# Altium project MC3_r2.PrjPcb (part 2 of 10)

## Sheet MC3_microcontroller.SchDoc
size Letter; DocumentNumber: D_17; SheetNumber: 17; SheetTotal: 21
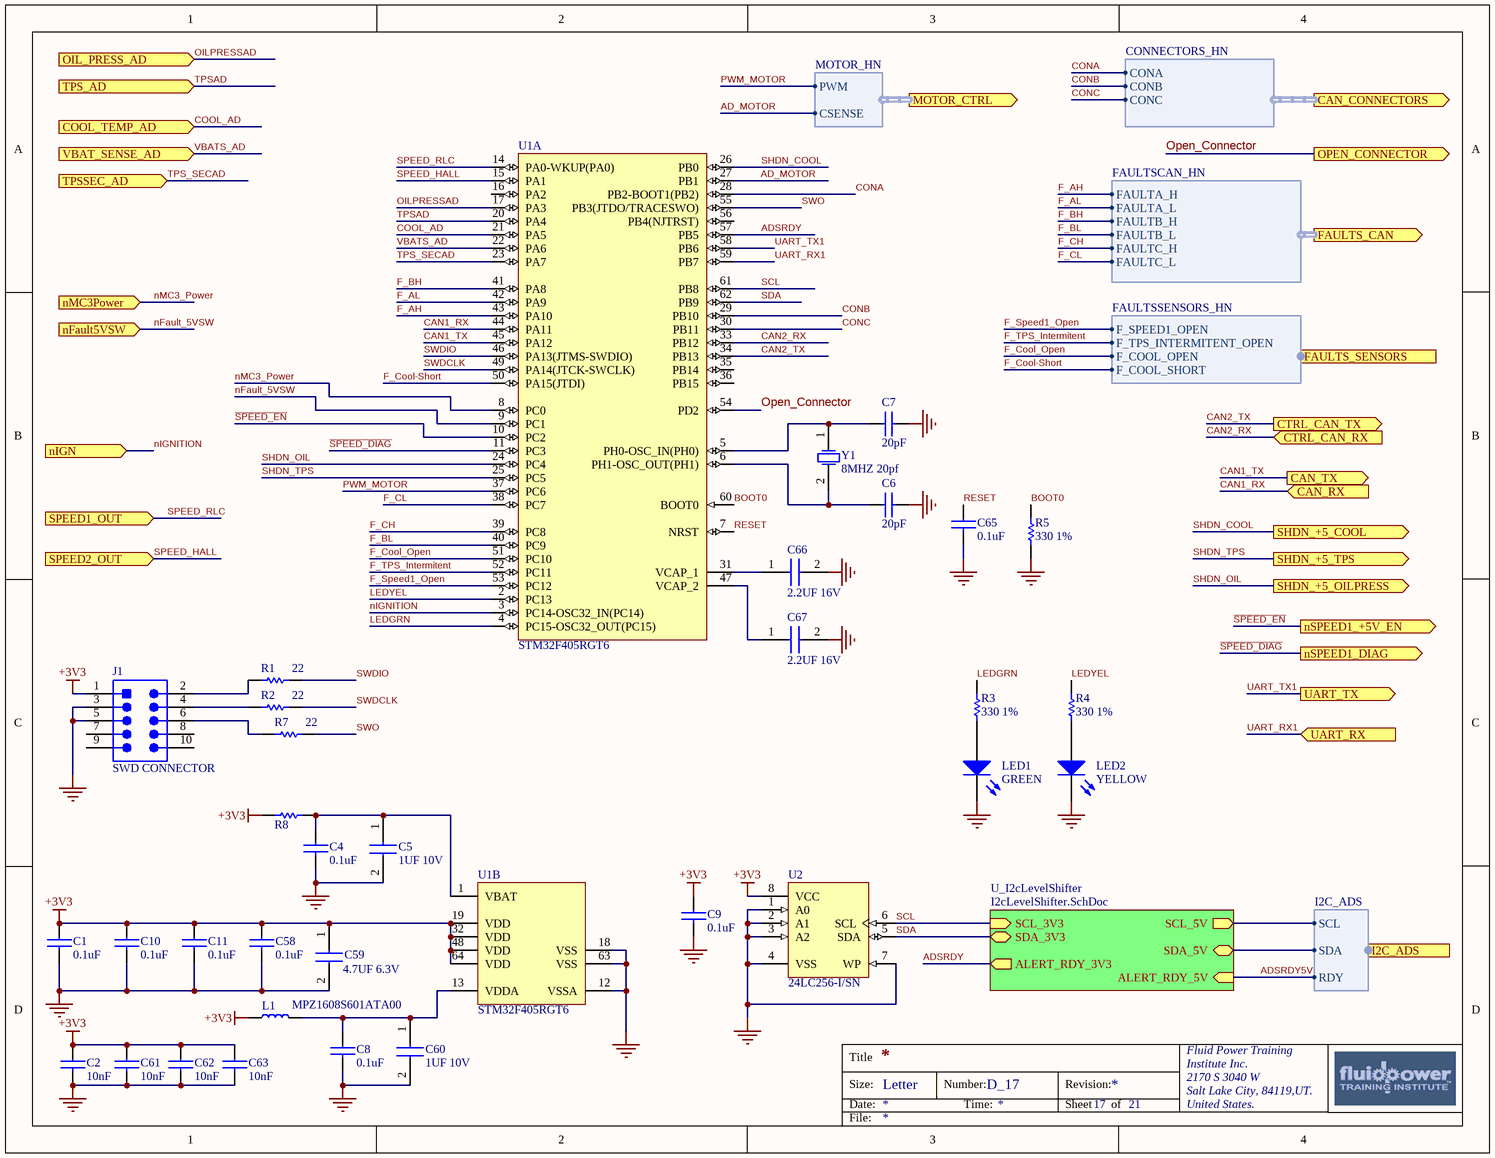
[diagram p4: MC3_microcontroller.SchDoc]

### Parts
C1  0.1uF  [C0805]
C2  10nF  [C0805]
C4  0.1uF  [C0805]
C5  1UF 10V  [CAPC1608X90X20LL10]
C6  20pF  [C0805]
C7  20pF  [C0805]
C8  0.1uF  [C0805]
C9  0.1uF  [C0805]
C10  0.1uF  [C0805]
C11  0.1uF  [C0805]
C58  0.1uF  [C0805]
C59  4.7UF 6.3V  [CAPC1608X90X20LL10]
C60  1UF 10V  [CAPC1608X90X20LL10]
C61  10nF  [C0805]
C62  10nF  [C0805]
C63  10nF  [C0805]
C65  0.1uF  [C0805]
C66  2.2UF 16V  [CAPC1608X09M]
C67  2.2UF 16V  [CAPC1608X09M]
J1  SWD CONNECTOR  [SMTC-FTSH-105-01-L-DV-K_V]
L1  MPZ1608S601ATA00  [INDC1608X06L]
LED1  GREEN  [LED0805]
LED2  YELLOW  [LED0805]
R1  22  [R0805]
R2  22  [R0805]
R3  330 1%  [R0805]
R4  330 1%  [R0805]
R5  330 1%  [R0805]
R7  22  [R0805]
R8  0 OHM  [R0805]  (value not drawn)
U1  STM32F405RGT6  [STM-LQFP64_V]  (parts A,B of 2)
U2  24LC256-I/SN  [SOIC-SN8_L]
Y1  8MHZ 20pf  [HC49US]

### Sub-sheets
U_I2cLevelShifter = I2cLevelShifter.SchDoc: SDA_3V3 (bidir), SDA_5V (bidir), SCL_3V3 (in), SCL_5V (out), ALERT_RDY_3V3 (out), ALERT_RDY_5V (in)

### Ports
CAN_CONNECTORS (out, harness CONNECTORS_HN), CAN_RX (in), CAN_TX (out), COOL_TEMP_AD (in), CTRL_CAN_RX (in), CTRL_CAN_TX (out), FAULTS_CAN (out, harness FAULTSCAN_HN), FAULTS_SENSORS (in, harness FAULTSSENSORS_HN), I2C_ADS (in, harness I2C_ADS), MOTOR_CTRL (out, harness MOTOR_HN), nFault5VSW (in), nIGN (in), nMC3Power (in), nSPEED1_+5V_EN (out), nSPEED1_DIAG (out), OIL_PRESS_AD (in), OPEN_CONNECTOR (out), SHDN_+5_COOL (out), SHDN_+5_OILPRESS (out), SHDN_+5_TPS (out), SPEED1_OUT (in), SPEED2_OUT (in), TPS_AD (in), TPSSEC_AD (in), UART_RX (in), UART_TX (out), VBAT_SENSE_AD (in)

### Harnesses
I2C_ADS: SCL, SDA, RDY
MOTOR_HN: PWM, CSENSE
FAULTSCAN_HN: FAULTA_H, FAULTA_L, FAULTB_H, FAULTB_L, FAULTC_H, FAULTC_L
CONNECTORS_HN: CONA, CONB, CONC
FAULTSSENSORS_HN: F_SPEED1_OPEN, F_TPS_INTERMITENT_OPEN, F_COOL_OPEN, F_COOL_SHORT

### Nets
+3V3: C1.1 C2.1 C9.1 C10.1 C11.1 C58.1 C59.1 C61.1 C62.1 C63.1 J1.1 L1.1 R8.1 U1.19(VDD) U1.32(VDD) U1.48(VDD) U1.64(VDD) U2.8(VCC)
GND: C1.2 C2.2 C4.2 C5.2 C6.2 C7.2 C8.2 C9.2 C10.2 C11.2 C58.2 C59.2 C60.2 C61.2 C62.2 C63.2 C65.2 C66.2 C67.2 J1.3 J1.5 LED1.1(K) LED2.1(K) R5.1 U1.12(VSSA) U1.18(VSS) U1.63(VSS) U2.1(A0) U2.2(A1) U2.3(A2) U2.4(VSS) U2.7(WP)
~{SPEED_DIAG}: U1.11(PC3) ; port nSPEED1_DIAG
~{SPEED_EN}: U1.10(PC2) ; port nSPEED1_+5V_EN
AD_MOTOR: U1.27(PB1) ; port MOTOR_CTRL.CSENSE
ADSRDY: U1.57(PB5) ; sheet U_I2cLevelShifter/ALERT_RDY_3V3
ADSRDY5V: sheet U_I2cLevelShifter/ALERT_RDY_5V, port I2C_ADS.RDY
BOOT0: R5.2 U1.60(BOOT0)  [project net BOOT0_17]
CAN1_RX: U1.44(PA11) ; port CAN_RX
CAN1_TX: U1.45(PA12) ; port CAN_TX
CAN2_RX: U1.33(PB12) ; port CTRL_CAN_RX
CAN2_TX: U1.34(PB13) ; port CTRL_CAN_TX
CONA: U1.28(PB2-BOOT1(PB2)) ; port CAN_CONNECTORS.CONA
CONB: U1.29(PB10) ; port CAN_CONNECTORS.CONB
CONC: U1.30(PB11) ; port CAN_CONNECTORS.CONC
COOL_AD: U1.21(PA5) ; port COOL_TEMP_AD
F_AH: U1.43(PA10) ; port FAULTS_CAN.FAULTA_H  [project net FAULTAH]
F_AL: U1.42(PA9) ; port FAULTS_CAN.FAULTA_L  [project net FAULTAL]
F_BH: U1.41(PA8) ; port FAULTS_CAN.FAULTB_H  [project net FAULTBH]
F_BL: U1.40(PC9) ; port FAULTS_CAN.FAULTB_L  [project net FAULTBL]
F_CH: U1.39(PC8) ; port FAULTS_CAN.FAULTC_H  [project net FAULTCH]
F_CL: U1.38(PC7) ; port FAULTS_CAN.FAULTC_L  [project net FAULTCL]
F_Cool-Short: U1.50(PA15(JTDI)) ; port FAULTS_SENSORS.F_COOL_SHORT
F_Cool_Open: U1.51(PC10) ; port FAULTS_SENSORS.F_COOL_OPEN
F_Speed1_Open: U1.53(PC12) ; port FAULTS_SENSORS.F_SPEED1_OPEN
F_TPS_Intermitent: U1.52(PC11) ; port FAULTS_SENSORS.F_TPS_INTERMITENT_OPEN
LEDGRN: R3.2 U1.4(PC15-OSC32_OUT(PC15))  [project net LEDGRN_17]
LEDYEL: R4.2 U1.2(PC13)  [project net LEDYEL_17]
nFault_5VSW: U1.9(PC1) ; port nFault5VSW  [project net nFault5VSW]
nIGNITION: U1.3(PC14-OSC32_IN(PC14)) ; port nIGN
nMC3_Power: U1.8(PC0) ; port nMC3Power  [project net nMC3Power]
OILPRESSAD: U1.17(PA3) ; port OIL_PRESS_AD
Open_Connector: U1.54(PD2) ; port OPEN_CONNECTOR
PWM_MOTOR: U1.37(PC6) ; port MOTOR_CTRL.PWM
RESET: C65.1 U1.7(NRST)  [project net RESET_17]
SCL: U1.61(PB8) U2.6(SCL) ; sheet U_I2cLevelShifter/SCL_3V3
SDA: U1.62(PB9) U2.5(SDA) ; sheet U_I2cLevelShifter/SDA_3V3
SHDN_COOL: U1.26(PB0) ; port SHDN_+5_COOL
SHDN_OIL: U1.24(PC4) ; port SHDN_+5_OILPRESS
SHDN_TPS: U1.25(PC5) ; port SHDN_+5_TPS
SPEED_HALL: U1.15(PA1) ; port SPEED2_OUT
SPEED_RLC: U1.14(PA0-WKUP(PA0)) ; port SPEED1_OUT
SWDCLK: R2.2 U1.49(PA14(JTCK-SWCLK))  [project net SWDCLK_17]
SWDIO: R1.2 U1.46(PA13(JTMS-SWDIO))  [project net SWDIO_17]
SWO: R7.2 U1.55(PB3(JTDO/TRACESWO))  [project net SWO_17]
TPS_SECAD: U1.23(PA7) ; port TPSSEC_AD
TPSAD: U1.20(PA4) ; port TPS_AD
UART_RX1: U1.59(PB7) ; port UART_RX
UART_TX1: U1.58(PB6) ; port UART_TX
VBATS_AD: U1.22(PA6) ; port VBAT_SENSE_AD
NetC4_1: C4.1 C5.1 R8.2 U1.1(VBAT)
NetC6_1: C6.1 U1.6(PH1-OSC_OUT(PH1)) Y1.2
NetC7_1: C7.1 U1.5(PH0-OSC_IN(PH0)) Y1.1
NetC8_1: C8.1 C60.1 L1.2 U1.13(VDDA)
NetC66_1: C66.1 U1.31(VCAP_1)
NetC67_1: C67.1 U1.47(VCAP_2)
NetIC1_9: sheet U_I2cLevelShifter/SDA_5V, port I2C_ADS.SDA
NetIC1_10: sheet U_I2cLevelShifter/SCL_5V, port I2C_ADS.SCL
NetJ1_2: J1.2 R1.1
NetJ1_4: J1.4 R2.1
NetJ1_6: J1.6 R7.1
NetLED1_2: LED1.2(A) R3.1
NetLED2_2: LED2.2(A) R4.1

Not connected (* = marked no-connect by the designer): J1 7 8 9 10; U1 16(PA2) 35(PB14) 36(PB15) 56(PB4(NJTRST))

### Notes on the sheet
- Title
- Size:
- Date:
- Letter
- Number:
- Time:
- Revision:
- Sheet
- of
- Fluid Power Training
- Institute Inc.
- 2170 S 3040 W
- Salt Lake City, 84119,UT.
- United States.
- File:

### Library data of the parts
C1 C4 C8-C11 C58 C65 = C0805C104K5RACTU: Cap Ceramic 0.1uF 50V X7R 10% SMD 2.0 x 1.2 mm 125 C Paper T/R; Manufacturer: KEMET; Capacitance: 100nF; Voltage: 500V; Supplier 1: Mouser; Supplier Part Number 1: 80-C0805C104K5R; Manufacturer Part Number: C0805C104K5RACTU; RoHS: Yes; Category: Ceramic Capacitors; Stock 1: 4177670; Pricing 1: 1=0.17000, 10=0.10400, 100=0.05600, 500=0.03900, 1000=0.03200, 4000=0.02400 (USD); Mount: Surface Mount,PCB; Case/Package: 0805; Number of Pins: 2; Case Code (Imperial): 0805; Case Code (Metric): 2012; Dielectric Material: Ceramic; Contact Plating: Tin,Matte; Min Operating Temperature: -55°C; Max Operating Temperature: 125°C; Voltage Rating: 50V; Tolerance: 10%; Packaging: Tape and Reel; Dielectric: X7R; Package Quantity: 4000; Voltage Rating (DC): 50V; Termination: SMD/SMT; Length: 2mm; Height: 0.9mm; Width: 1.2mm; Depth: 1.25mm; Thickness: 0.035inch; Lead Pitch: 0.75mm; Radiation Hardening: No; REACH SVHC: No SVHC; ComponentLink1URL: https://datasheet.ciiva.com/14589/70095383-14589048.pdf?src-supplier=Allied+Electronics; ComponentLink1Description: https://datasheet.ciiva.com/14589/70095383-14589048.pdf?src-supplier=Allied+Electronics; ComponentLink2URL: https://datasheet.ciiva.com/28682/1851736-28682232.pdf?src-supplier=Element14; ComponentLink2Description: https://datasheet.ciiva.com/28682/1851736-28682232.pdf?src-supplier=Element14; ComponentLink3URL: https://datasheet.ciiva.com/32431/slceramic-chip-condensers-e-32431755.pdf?src-supplier=Distrelec; ComponentLink3Description: https://datasheet.ciiva.com/32431/slceramic-chip-condensers-e-32431755.pdf?src-supplier=Distrelec; ComponentLink4URL: https://datasheet.ciiva.com/18410/70095383-18410815.pdf?src-supplier=Allied+Electronics; ComponentLink4Description: https://datasheet.ciiva.com/18410/70095383-18410815.pdf?src-supplier=Allied+Electronics
C2 C61-C63 = CC0805KRX7R9BB103: YAGEO - CC0805KRX7R9BB103 - SMD Multilayer Ceramic Capacitor, 10000 pF, 50 V, 0805 [2012 Metric], ± 10%, X7R, CC Series; Voltage Rating: 50V; Insulation Resistance: 100GR; Supplier 1: Mouser; Supplier Part Number 1: 603-CC805KRX7R9BB103; Manufacturer: Yageo; Manufacturer Part Number: CC0805KRX7R9BB103; RoHS: Yes; Category: Ceramic Capacitors; Stock 1: 473100; Pricing 1: 1=0.11000, 10=0.05700, 100=0.02600, 1000=0.02100, 4000=0.01600, 8000=0.01400 (USD); Mount: Surface Mount; Case/Package: 0805; Number of Pins: 2; Case Code (Imperial): 0805; Case Code (Metric): 2012; Material: Ceramic; Min Operating Temperature: -55°C; Max Operating Temperature: 125°C; Packaging: Tape and Reel; Capacitance: 10nF; Tolerance: 10%; Package Quantity: 1; Dielectric: X7R; Termination: SMD/SMT; Voltage Rating (DC): 50V; Voltage: 50V; Composition: Ceramic; Length: 2mm; Height: 0.6mm; Width: 1.25mm; Depth: 1.25mm; Thickness: 0.024inch; Radiation Hardening: No; REACH SVHC: No SVHC; Lead Free: Lead Free; Halogen Free: Halogen Free; ComponentLink1URL: https://datasheet.ciiva.com/11786/0900766b80d84f1d-11786119.pdf?src-supplier=RSComponents; ComponentLink1Description: https://datasheet.ciiva.com/11786/0900766b80d84f1d-11786119.pdf?src-supplier=RSComponents; ComponentLink2URL: https://datasheet.ciiva.com/25613/0900766b8027bcf6-25613113.pdf?src-supplier=RSComponents; ComponentLink2Description: https://datasheet.ciiva.com/25613/0900766b8027bcf6-25613113.pdf?src-supplier=RSComponents; ComponentLink3URL: https://datasheet.ciiva.com/144/mlccorderingcode-144533.pdf?src-supplier=Digi-Key; ComponentLink3Description: https://datasheet.ciiva.com/144/mlccorderingcode-144533.pdf?src-supplier=Digi-Key; ComponentLink4URL: https://datasheet.ciiva.com/144/mlccorderingcode-144534.pdf?src-supplier=Digi-Key; ComponentLink4Description: https://datasheet.ciiva.com/144/mlccorderingcode-144534.pdf?src-supplier=Digi-Key; ComponentLink5URL: https://datasheet.ciiva.com/46372/1784427-46372638.pdf?src-supplier=Element14; ComponentLink5Description: https://datasheet.ciiva.com/46372/1784427-46372638.pdf?src-supplier=Element14; ComponentLink6URL: https://datasheet.ciiva.com/144/mlccorderingcode-144532.pdf?src-supplier=Digi-Key; ComponentLink6Description: https://datasheet.ciiva.com/144/mlccorderingcode-144532.pdf?src-supplier=Digi-Key; ComponentLink7URL: https://datasheet.ciiva.com/16625/upy-gphc-x7r-6-3v-to-50v-8-16625548.pdf?src-supplier=Avnet+Europe; ComponentLink7Description: https://datasheet.ciiva.com/16625/upy-gphc-x7r-6-3v-to-50v-8-16625548.pdf?src-supplier=Avnet+Europe; ComponentLink8URL: https://datasheet.ciiva.com/22749/1489800-22749215.pdf?src-supplier=Element14; ComponentLink8Description: https://datasheet.ciiva.com/22749/1489800-22749215.pdf?src-supplier=Element14; ComponentLink9URL: https://datasheet.ciiva.com/46372/1734573-46372639.pdf?src-supplier=Element14; ComponentLink9Description: https://datasheet.ciiva.com/46372/1734573-46372639.pdf?src-supplier=Element14
C5 C60 = C0603C105K8PACTU: Cap Ceramic 1uF 10V X5R 10% SMD 0603 85°C Paper T/R; Manufacturer: KEMET; Supplier 1: Mouser; Supplier Part Number 1: 80-C0603C105K8P; Manufacturer Part Number: C0603C105K8PACTU; RoHS: Yes; Category: Ceramic Capacitors; Stock 1: 122683; Pricing 1: 1=0.10000, 10=0.06100, 100=0.02700, 500=0.01900, 1000=0.01500, 4000=0.01100 (USD); Mount: Surface Mount; Case/Package: 0603; Number of Pins: 2; Weight: 7.1E-05oz; Case Code (Imperial): 0603; Case Code (Metric): 1608; Dielectric Material: Ceramic; Min Operating Temperature: -55°C; Max Operating Temperature: 85°C; Tolerance: 10%; Capacitance: 1uF; Packaging: Tape and Reel; Dielectric: X5R; Voltage Rating (DC): 10V; Voltage Rating: 10V; Package Quantity: 1; Termination: SMD/SMT; Voltage: 10V; Length: 1.6mm; Height: 0.8mm; Depth: 0.8mm; Width: 0.031inch; Thickness: 0.035inch; Radiation Hardening: No; REACH SVHC: No SVHC; Lead Free: Lead Free; ComponentLink1URL: https://datasheet.ciiva.com/11787/0900766b8116eb59-11787747.pdf?src-supplier=RSComponents; ComponentLink1Description: https://datasheet.ciiva.com/11787/0900766b8116eb59-11787747.pdf?src-supplier=RSComponents; ComponentLink2URL: https://datasheet.ciiva.com/7823/1929483-7823999.pdf?src-supplier=Element14; ComponentLink2Description: https://datasheet.ciiva.com/7823/1929483-7823999.pdf?src-supplier=Element14; ComponentLink3URL: https://datasheet.ciiva.com/6074/40889-6074647.pdf?src-supplier=Farnell; ComponentLink3Description: https://datasheet.ciiva.com/6074/40889-6074647.pdf?src-supplier=Farnell; ComponentLink4URL: https://datasheet.ciiva.com/28645/1831760-28645655.pdf?src-supplier=Element14; ComponentLink4Description: https://datasheet.ciiva.com/28645/1831760-28645655.pdf?src-supplier=Element14; ComponentLink5URL: https://datasheet.ciiva.com/26847/getdatasheetpartid-385480-26847548.pdf?src-supplier=Verical; ComponentLink5Description: https://datasheet.ciiva.com/26847/getdatasheetpartid-385480-26847548.pdf?src-supplier=Verical; ComponentLink6URL: https://datasheet.ciiva.com/7823/40889-7823998.pdf?src-supplier=Element14; ComponentLink6Description: https://datasheet.ciiva.com/7823/40889-7823998.pdf?src-supplier=Element14
C6 C7 = 08051A200JAT2A: AVX - 08051A200JAT2A - CERAMIC CAPACITOR 20PF 100V, C0G, 5%, 0805, FULL REEL; Manufacturer: Kyocera AVX; Dissipation Factor: 10%; Temperature Coefficient: 30ppm/°C; Supplier 1: Mouser; Supplier Part Number 1: 581-08051A200JAT2A; Manufacturer Part Number: 08051A200JAT2A; RoHS: Yes; Category: Ceramic Capacitors; Stock 1: 29281; Pricing 1: 1=0.29000, 10=0.19900, 100=0.10000, 500=0.06900, 1000=0.06100, 2000=0.06100 (USD); Mount: Surface Mount,PCB; Case/Package: 0805; Number of Pins: 2; Case Code (Imperial): 0805; Case Code (Metric): 2012; Contact Plating: Tin,Matte; Min Operating Temperature: -55°C; Max Operating Temperature: 125°C; Capacitance: 20pF; Packaging: Tape and Reel; Voltage Rating: 100V; Package Quantity: 1; Tolerance: 5%; Voltage Rating (DC): 100V; Dielectric: C0G; Termination: SMD/SMT; Voltage: 100V; Length: 2.01mm; Height: 940um; Width: 1.25mm; Thickness: 0.037inch; Depth: 1.25mm; Radiation Hardening: No; Lead Free: Lead Free; REACH SVHC: No SVHC; ComponentLink1URL: https://datasheet.ciiva.com/11787/0900766b80def0e2-11787350.pdf?src-supplier=RSComponents; ComponentLink1Description: https://datasheet.ciiva.com/11787/0900766b80def0e2-11787350.pdf?src-supplier=RSComponents; ComponentLink2URL: https://datasheet.ciiva.com/26927/getdatasheetpartid-58326-26927326.pdf?src-supplier=Verical; ComponentLink2Description: https://datasheet.ciiva.com/26927/getdatasheetpartid-58326-26927326.pdf?src-supplier=Verical; ComponentLink3URL: https://datasheet.ciiva.com/11536/ccog-11536935.pdf?src-supplier=Avnet; ComponentLink3Description: https://datasheet.ciiva.com/11536/ccog-11536935.pdf?src-supplier=Avnet; ComponentLink4URL: https://datasheet.ciiva.com/151/ccog-151320.pdf?src-supplier=Digi-Key; ComponentLink4Description: https://datasheet.ciiva.com/151/ccog-151320.pdf?src-supplier=Digi-Key; ComponentLink5URL: https://datasheet.ciiva.com/151/ccog-151321.pdf?src-supplier=Digi-Key; ComponentLink5Description: https://datasheet.ciiva.com/151/ccog-151321.pdf?src-supplier=Digi-Key; ComponentLink6URL: https://datasheet.ciiva.com/28535/759117-28535065.pdf?src-supplier=Element14; ComponentLink6Description: https://datasheet.ciiva.com/28535/759117-28535065.pdf?src-supplier=Element14; ComponentLink7URL: https://datasheet.ciiva.com/151/ccog-151322.pdf?src-supplier=Digi-Key; ComponentLink7Description: https://datasheet.ciiva.com/151/ccog-151322.pdf?src-supplier=Digi-Key; ComponentLink8URL: https://datasheet.ciiva.com/14606/70001039-14606635.pdf?src-supplier=Allied+Electronics; ComponentLink8Description: https://datasheet.ciiva.com/14606/70001039-14606635.pdf?src-supplier=Allied+Electronics; ComponentLink9URL: https://datasheet.ciiva.com/14595/70001039-14595420.pdf?src-supplier=Allied+Electronics; ComponentLink9Description: https://datasheet.ciiva.com/14595/70001039-14595420.pdf?src-supplier=Allied+Electronics; ComponentLink10URL: https://datasheet.ciiva.com/2987/ccog-2987917.pdf?src-supplier=Avnet; ComponentLink10Description: https://datasheet.ciiva.com/2987/ccog-2987917.pdf?src-supplier=Avnet; ComponentLink11URL: https://datasheet.ciiva.com/17492/ccog-17492879.pdf?src-supplier=Avnet+Europe; ComponentLink11Description: https://datasheet.ciiva.com/17492/ccog-17492879.pdf?src-supplier=Avnet+Europe
C59 = C0603C475K9PACTU: KEMET - C0603C475K9PACTU - KONDENSATOR, 4.7µF, 6.3V, 10%, X5R, 0603; Dielectric Material: Ceramic; Dissipation Factor: 5%; Supplier 1: Mouser; Supplier Part Number 1: 80-C0603C475K9P; Manufacturer: KEMET; Manufacturer Part Number: C0603C475K9PACTU; RoHS: Yes; Category: Ceramic Capacitors; Stock 1: 258514; Pricing 1: 1=0.17000, 10=0.12000, 100=0.05600, 500=0.03900, 1000=0.03200, 4000=0.02400 (USD); Mount: Surface Mount,PCB; Case/Package: 0603; Number of Pins: 2; Case Code (Metric): 1608; Case Code (Imperial): 0603; Contact Plating: Tin,Matte; Min Operating Temperature: -55°C; Max Operating Temperature: 85°C; Capacitance: 4.7uF; Voltage Rating: 6.3V; Tolerance: 10%; Packaging: Tape and Reel; Package Quantity: 1; Voltage Rating (DC): 6.3V; Termination: SMD/SMT; Dielectric: X5R; Voltage: 6.3V; Length: 1.6mm; Height: 0.8mm; Width: 0.031inch; Depth: 0.8mm; Thickness: 0.035inch; Lead Pitch: 0.7mm; Radiation Hardening: No; Lead Free: Lead Free; REACH SVHC: No SVHC; ComponentLink1URL: https://datasheet.ciiva.com/145/docfinderpartnumber-c0603c475k9pactu-145072.pdf?src-supplier=Digi-Key; ComponentLink1Description: https://datasheet.ciiva.com/145/docfinderpartnumber-c0603c475k9pactu-145072.pdf?src-supplier=Digi-Key; ComponentLink2URL: https://datasheet.ciiva.com/7823/1732700-7823808.pdf?src-supplier=Element14; ComponentLink2Description: https://datasheet.ciiva.com/7823/1732700-7823808.pdf?src-supplier=Element14; ComponentLink3URL: https://datasheet.ciiva.com/28682/1789732-28682301.pdf?src-supplier=Element14; ComponentLink3Description: https://datasheet.ciiva.com/28682/1789732-28682301.pdf?src-supplier=Element14; ComponentLink4URL: https://datasheet.ciiva.com/7824/40889-7824047.pdf?src-supplier=Element14; ComponentLink4Description: https://datasheet.ciiva.com/7824/40889-7824047.pdf?src-supplier=Element14
C66 C67 = C0603C225K4PACTU: KEMET - C0603C225K4PACTU - CAP, MLCC, X5R, 2.2UF, 16V, 0603; Dielectric Material: Ceramic; Tolerance: 10%; Dissipation Factor: 5%; Supplier 1: Mouser; Supplier Part Number 1: 80-C0603C225K4P; Manufacturer: KEMET; Manufacturer Part Number: C0603C225K4PACTU; RoHS: Yes; Category: Ceramic Capacitors; Stock 1: 77579; Pricing 1: 1=0.14000, 10=0.10300, 100=0.04800, 500=0.03400, 1000=0.02800, 4000=0.02000 (USD); Mount: Surface Mount; Case/Package: 0603; Number of Pins: 2; Case Code (Imperial): 0603; Case Code (Metric): 1608; Contact Plating: Tin,Matte; Min Operating Temperature: -55°C; Max Operating Temperature: 85°C; Capacitance: 2.2uF; Voltage Rating: 16V; Voltage Rating (DC): 16V; Packaging: Tape and Reel; Package Quantity: 1; Termination: SMD/SMT; Dielectric: X5R; Voltage: 16V; Length: 1.6mm; Height: 0.8mm; Width: 0.8mm; Depth: 0.8mm; Thickness: 0.034inch; Radiation Hardening: No; Lead Free: Lead Free; REACH SVHC: No SVHC; ComponentLink1URL: https://datasheet.ciiva.com/5969/1776083-5969304.pdf?src-supplier=Farnell; ComponentLink1Description: https://datasheet.ciiva.com/5969/1776083-5969304.pdf?src-supplier=Farnell; ComponentLink2URL: https://datasheet.ciiva.com/7823/1776083-7823706.pdf?src-supplier=Element14; ComponentLink2Description: https://datasheet.ciiva.com/7823/1776083-7823706.pdf?src-supplier=Element14
J1 = FTSH-105-01-F-DV-K: SAMTEC - FTSH-105-01-F-DV-K - HEADER, 1.27 MM, SURFACE MOUNT, 10 CONTACTS; Number of Contacts: 10; Connector Type: Male Pin; Max Current Rating: 1.75A; Pitch: 1.27mm; Row Spacing: 0.05inch; Supplier 1: Mouser; Supplier Part Number 1: 200-FTSH10501FDVK; Manufacturer: Samtec; Manufacturer Part Number: FTSH-105-01-F-DV-K; RoHS: Yes; Category: Headers and Wire Housings; Stock 1: 5484; Pricing 1: 1=3.02000, 10=2.55000, 25=2.20000, 100=1.97000, 250=1.86000, 500=1.62000 (USD); Mount: Surface Mount; Contact Plating: Gold; Contact Material: Copper,Bronze; Housing Color: Black; Housing Material: Polymer; Color: Black; Min Operating Temperature: -55°C; Max Operating Temperature: 125°C; Number of Rows: 2; Termination: Solder; Packaging: Rail/Tube; Orientation: Straight; Number of Positions: 10; Package Quantity: 1; Length: 15.2mm; Height: 3.3mm; Depth: 3.43mm; Contact Mating Length: 0.12inch; Radiation Hardening: No; Lead Free: Lead Free; ComponentLink1URL: https://datasheet.ciiva.com/19461/2046846-19461026.pdf?src-supplier=Jameco; ComponentLink1Description: https://datasheet.ciiva.com/19461/2046846-19461026.pdf?src-supplier=Jameco; ComponentLink2URL: https://datasheet.ciiva.com/738/ftsh-1xx-xx-xxx-dv-xxx-mkt-738998.pdf?src-supplier=Digi-Key; ComponentLink2Description: https://datasheet.ciiva.com/738/ftsh-1xx-xx-xxx-dv-xxx-mkt-738998.pdf?src-supplier=Digi-Key; ComponentLink3URL: https://datasheet.ciiva.com/10245/ftsh-mt-10245273.pdf?src-supplier=Avnet; ComponentLink3Description: https://datasheet.ciiva.com/10245/ftsh-mt-10245273.pdf?src-supplier=Avnet; ComponentLink4URL: https://datasheet.ciiva.com/16657/ftsh-mt-16657371.pdf?src-supplier=Avnet+Europe; ComponentLink4Description: https://datasheet.ciiva.com/16657/ftsh-mt-16657371.pdf?src-supplier=Avnet+Europe; ComponentLink5URL: https://datasheet.ciiva.com/15195/getdatasheetpartid-133463-15195260.pdf?src-supplier=Verical; ComponentLink5Description: https://datasheet.ciiva.com/15195/getdatasheetpartid-133463-15195260.pdf?src-supplier=Verical
L1 = MPZ1608S601ATA00: TDK         MPZ1608S601ATA00            FERRITE BEAD, 0.15OHM, 1A, 0603, FULL REEL; Manufacturer: TDK EPCOS; Impedance: 600R; Tolerance: 25%; DC Resistance (DCR): 150mR; Test Frequency: 100MHz; Supplier 1: Mouser; Supplier Part Number 1: 810-MPZ1608S601ATA00; Manufacturer Part Number: MPZ1608S601ATA00; RoHS: Yes; Category: Ferrite Beads and Chips; Stock 1: 62; Pricing 1: 1=0.10000, 10=0.07600, 100=0.03300, 500=0.03000, 1000=0.02600, 4000=0.02000 (USD); Mount: Surface Mount; Case/Package: 0603; Weight: 7.1E-05oz; Core Material: Ferrite; Case Code (Metric): 1608; Case Code (Imperial): 0603; Min Operating Temperature: -55°C; Max Operating Temperature: 125°C; Max DC Current: 1A; Termination: SMD/SMT; Packaging: Tape and Reel; Package Quantity: 4000; Current Rating: 1A; Length: 0.063inch; Height: 0.8mm; Width: 0.8mm; Depth: 0.8mm; Lead Free: Lead Free; REACH SVHC: No SVHC; ComponentLink1URL: https://datasheet.ciiva.com/46381/1795297-46381701.pdf?src-supplier=Element14; ComponentLink1Description: https://datasheet.ciiva.com/46381/1795297-46381701.pdf?src-supplier=Element14; ComponentLink2URL: https://datasheet.ciiva.com/46634/beads-commercial-power-mpz-en-46634518.pdf?src-supplier=Digi-Key; ComponentLink2Description: https://datasheet.ciiva.com/46634/beads-commercial-power-mpz-en-46634518.pdf?src-supplier=Digi-Key; ComponentLink3URL: https://datasheet.ciiva.com/46634/beads-commercial-power-mpz-en-46634462.pdf?src-supplier=Digi-Key; ComponentLink3Description: https://datasheet.ciiva.com/46634/beads-commercial-power-mpz-en-46634462.pdf?src-supplier=Digi-Key; ComponentLink4URL: https://datasheet.ciiva.com/46634/beads-commercial-power-mpz-en-46634494.pdf?src-supplier=Digi-Key; ComponentLink4Description: https://datasheet.ciiva.com/46634/beads-commercial-power-mpz-en-46634494.pdf?src-supplier=Digi-Key
LED1 = 150080VS75000: LED GREEN CLEAR 0805 SMD; Manufacturer: Wurth Electronics; Forward Voltage: 2V; Lens Style: Clear,Rectangular; Luminous Intensity: 40mcd; Forward Current: 30mA; Viewing Angle: 140°; Wavelength: 570nm; Test Current: 20mA; Supplier 1: Mouser; Supplier Part Number 1: 710-150080VS75000; Manufacturer Part Number: 150080VS75000; RoHS: Yes; Category: LEDs; Stock 1: 16574; Pricing 1: 1=0.18000, 10=0.17500, 25=0.17400, 50=0.16200, 100=0.13900, 250=0.12300 (USD); Mount: Surface Mount; Case/Package: 0805; Color: Green; Case Code (Metric): 2012; Case Code (Imperial): 0805; Min Operating Temperature: -40°C; Max Operating Temperature: 85°C; Packaging: Tape and Reel; Dominant Wavelength: 570nm; Package Quantity: 4000; Length: 2mm; Height: 0.7mm; Width: 1.25mm; REACH SVHC: Unknown; ComponentLink1URL: https://datasheet.ciiva.com/22656/150080vs75000-22656966.pdf?src-supplier=Element14; ComponentLink1Description: https://datasheet.ciiva.com/22656/150080vs75000-22656966.pdf?src-supplier=Element14; ComponentLink2URL: https://datasheet.ciiva.com/29279/759437-da-01-en-chipled-0805-w-kl-h-gruen-150080vs7500-29279047.pdf?src-supplier=Conrad; ComponentLink2Description: https://datasheet.ciiva.com/29279/759437-da-01-en-chipled-0805-w-kl-h-gruen-150080vs7500-29279047.pdf?src-supplier=Conrad; ComponentLink3URL: https://datasheet.ciiva.com/29563/150080vs75000-29563018.pdf?src-supplier=Digi-Key; ComponentLink3Description: https://datasheet.ciiva.com/29563/150080vs75000-29563018.pdf?src-supplier=Digi-Key
LED2 = 150080YS75000: LED YELLOW CLEAR 0805 SMD; Manufacturer: Wurth Electronics; Forward Voltage: 2V; Luminous Intensity: 120mcd; Viewing Angle: 140°; Forward Current: 30mA; Lens Style: Clear,Rectangular; Dominant Wavelength: 590nm; Test Current: 20mA; Supplier 1: Mouser; Supplier Part Number 1: 710-150080YS75000; Manufacturer Part Number: 150080YS75000; RoHS: Yes; Category: LEDs; Stock 1: 18730; Pricing 1: 1=0.18000, 10=0.17400, 25=0.17400, 50=0.16200, 100=0.13900, 250=0.12400 (USD); Mount: Surface Mount; Case/Package: 0805; Color: Yellow; Case Code (Metric): 2012; Case Code (Imperial): 0805; Min Operating Temperature: -40°C; Max Operating Temperature: 85°C; Packaging: Tape and Reel; Wavelength: 590nm; Package Quantity: 4000; Length: 2mm; Height: 0.7mm; Width: 1.25mm; REACH SVHC: Unknown; ComponentLink1URL: https://datasheet.ciiva.com/23843/150080ys75000-23843256.pdf?src-supplier=Newark; ComponentLink1Description: https://datasheet.ciiva.com/23843/150080ys75000-23843256.pdf?src-supplier=Newark; ComponentLink2URL: https://datasheet.ciiva.com/29279/759438-da-01-en-chipled-0805-w-kl-gelb-150080ys75000-29279034.pdf?src-supplier=Conrad; ComponentLink2Description: https://datasheet.ciiva.com/29279/759438-da-01-en-chipled-0805-w-kl-gelb-150080ys75000-29279034.pdf?src-supplier=Conrad; ComponentLink3URL: https://datasheet.ciiva.com/22656/1911353-22656971.pdf?src-supplier=Element14; ComponentLink3Description: https://datasheet.ciiva.com/22656/1911353-22656971.pdf?src-supplier=Element14; ComponentLink4URL: https://datasheet.ciiva.com/29563/150080ys75000-29563019.pdf?src-supplier=Digi-Key; ComponentLink4Description: https://datasheet.ciiva.com/29563/150080ys75000-29563019.pdf?src-supplier=Digi-Key; ComponentLink5URL: https://datasheet.ciiva.com/29563/150080ys75000-29563020.pdf?src-supplier=Digi-Key; ComponentLink5Description: https://datasheet.ciiva.com/29563/150080ys75000-29563020.pdf?src-supplier=Digi-Key; ComponentLink6URL: https://datasheet.ciiva.com/29563/150080ys75000-29563021.pdf?src-supplier=Digi-Key; ComponentLink6Description: https://datasheet.ciiva.com/29563/150080ys75000-29563021.pdf?src-supplier=Digi-Key
R1 R2 R7 = CRCW080522R0JNEA: Resistor;  Thick Film;  22 Ohms;  0.125 W;  5%;  SMT;  0805;  TCR 73 ppm/DegC;  Cut Tape; Manufacturer: Vishay Dale; Resistance: 22R; Temperature Coefficient: 200ppm/°C; Power Rating: 125mW; Voltage Rating: 150V; Supplier 1: Mouser; Manufacturer Part Number: CRCW080522R0JNEA; RoHS: Yes; Stock 1: 32788; Pricing 1: 1=0.10000, 10=0.03900, 100=0.01500, 1000=0.00600, 5000=0.00400, 10000=0.00400 (USD); Supplier Part Number 1: 71-CRCW080522R0JNEA; Category: Chip SMD Resistors; Case/Package: 0805; Weight: 0.000194oz; Case Code (Imperial): 0805; Case Code (Metric): 2012; Contact Plating: Tin; Min Operating Temperature: -55°C; Max Operating Temperature: 155°C; Tolerance: 5%; Packaging: Tape and Reel; Composition: Thick Film; Number of Terminations: 2; Max Power Dissipation: 125mW; Termination: Solder; Package Quantity: 5000; Voltage Rating (DC): 150V; Features: Automotive AEC-Q200; Military Standard: Not; Length: 2mm; Height: 0.02inch; Width: 1.25mm; Depth: 1.25mm; Radiation Hardening: No; Lead Free: Lead Free; REACH SVHC: Unknown; ComponentLink1URL: https://datasheet.ciiva.com/28606/1847332-28606766.pdf?src-supplier=Element14; ComponentLink1Description: https://datasheet.ciiva.com/28606/1847332-28606766.pdf?src-supplier=Element14; ComponentLink2URL: https://datasheet.ciiva.com/22871/70201119-22871903.pdf?src-supplier=Allied+Electronics; ComponentLink2Description: https://datasheet.ciiva.com/22871/70201119-22871903.pdf?src-supplier=Allied+Electronics; ComponentLink3URL: https://datasheet.ciiva.com/2464/dcrcwe3-2464258.pdf?src-supplier=Digi-Key; ComponentLink3Description: https://datasheet.ciiva.com/2464/dcrcwe3-2464258.pdf?src-supplier=Digi-Key; ComponentLink4URL: https://datasheet.ciiva.com/16358/dcrcwe3-16358364.pdf?src-supplier=Future+Electronics; ComponentLink4Description: https://datasheet.ciiva.com/16358/dcrcwe3-16358364.pdf?src-supplier=Future+Electronics; ComponentLink5URL: https://datasheet.ciiva.com/16769/70201119-16769711.pdf?src-supplier=Allied+Electronics; ComponentLink5Description: https://datasheet.ciiva.com/16769/70201119-16769711.pdf?src-supplier=Allied+Electronics
R3-R5 = ERJ-6ENF3300V: RES SMD 330 OHM 1% 1/8W 0805; Manufacturer: Panasonic; Resistance: 330R; Power Rating: 125mW; Temperature Coefficient: 100ppm/°C; Voltage Rating: 150V; Supplier 1: Mouser; Supplier Part Number 1: 667-ERJ-6ENF3300V; Manufacturer Part Number: ERJ-6ENF3300V; RoHS: Yes; Category: Chip SMD Resistors; Stock 1: 121287; Pricing 1: 1=0.10000, 10=0.08900, 100=0.03500, 500=0.03500, 1000=0.01900, 5000=0.01700 (USD); Mount: Surface Mount; Case/Package: 0805; Number of Pins: 2; Case Code (Imperial): 0805; Case Code (Metric): 2012; Contact Plating: Tin; Min Operating Temperature: -55°C; Max Operating Temperature: 155°C; Packaging: Tape and Reel; Tolerance: 1%; Composition: Thick Film; Termination: SMD/SMT; Number of Terminations: 2; Max Power Dissipation: 125mW; Package Quantity: 1; Military Standard: Not; Features: Automotive AEC-Q200; Length: 2mm; Height: 0.6mm; Width: 1.2mm; Depth: 1.25mm; Radiation Hardening: No; REACH SVHC: No SVHC; ComponentLink1URL: https://datasheet.ciiva.com/11821/0900766b80f80784-11821635.pdf?src-supplier=RSComponents; ComponentLink1Description: https://datasheet.ciiva.com/11821/0900766b80f80784-11821635.pdf?src-supplier=RSComponents; ComponentLink2URL: https://datasheet.ciiva.com/30131/aoa0000ce2-30131349.pdf?src-supplier=Onlinecomponents.com; ComponentLink2Description: https://datasheet.ciiva.com/30131/aoa0000ce2-30131349.pdf?src-supplier=Onlinecomponents.com; ComponentLink3URL: https://datasheet.ciiva.com/24025/aoa0000ce2-24025991.pdf?src-supplier=Mouser; ComponentLink3Description: https://datasheet.ciiva.com/24025/aoa0000ce2-24025991.pdf?src-supplier=Mouser; ComponentLink4URL: https://datasheet.ciiva.com/17206/aoa0000ce2-17206152.pdf?src-supplier=Avnet+Europe; ComponentLink4Description: https://datasheet.ciiva.com/17206/aoa0000ce2-17206152.pdf?src-supplier=Avnet+Europe; ComponentLink5URL: https://datasheet.ciiva.com/46436/1678782-46436633.pdf?src-supplier=Element14; ComponentLink5Description: https://datasheet.ciiva.com/46436/1678782-46436633.pdf?src-supplier=Element14; ComponentLink6URL: https://datasheet.ciiva.com/46436/1678782-46436634.pdf?src-supplier=Element14; ComponentLink6Description: https://datasheet.ciiva.com/46436/1678782-46436634.pdf?src-supplier=Element14; ComponentLink7URL: https://datasheet.ciiva.com/16760/70260748-16760668.pdf?src-supplier=Allied+Electronics; ComponentLink7Description: https://datasheet.ciiva.com/16760/70260748-16760668.pdf?src-supplier=Allied+Electronics; ComponentLink8URL: https://datasheet.ciiva.com/16780/70260748-16780764.pdf?src-supplier=Allied+Electronics; ComponentLink8Description: https://datasheet.ciiva.com/16780/70260748-16780764.pdf?src-supplier=Allied+Electronics; ComponentLink9URL: https://datasheet.ciiva.com/22684/1678782-22684798.pdf?src-supplier=Element14; ComponentLink9Description: https://datasheet.ciiva.com/22684/1678782-22684798.pdf?src-supplier=Element14; ComponentLink10URL: https://datasheet.ciiva.com/28590/1678782-28590783.pdf?src-supplier=Element14; ComponentLink10Description: https://datasheet.ciiva.com/28590/1678782-28590783.pdf?src-supplier=Element14
R8 = RK73Z2ATTD: Res Thick Film 0805 0 Ohm Pad SMD Automotive T/R; Manufacturer: KOA Speer; Resistance: 0mR; Power Rating: 2W; Tolerance: 1%; Temperature Coefficient: 400ppm/°C; Supplier 1: Mouser; Supplier Part Number 1: 660-RK73Z2ATTD; Manufacturer Part Number: RK73Z2ATTD; RoHS: Yes; Category: Chip SMD Resistors; Stock 1: 381276; Pricing 1: 1=0.10000, 10=0.09500, 100=0.09500, 1000=0.09500, 5000=0.00500, 10000=0.00400 (USD); Case/Package: 0805; Case Code (Imperial): 0805; Case Code (Metric): 2012; Min Operating Temperature: -55°C; Max Operating Temperature: 155°C; Packaging: Tape and Reel; Composition: Thick Film; Termination: SMD/SMT; Package Quantity: 5000; Military Standard: Not; Length: 2mm; Height: 0.5mm; Width: 1.25mm; Depth: 1.25mm; Lead Free: Lead Free; REACH SVHC: Unknown; ComponentLink1URL: https://datasheet.ciiva.com/7816/549012-7816885.pdf?src-supplier=Element14; ComponentLink1Description: https://datasheet.ciiva.com/7816/549012-7816885.pdf?src-supplier=Element14; ComponentLink2URL: https://datasheet.ciiva.com/15159/getdatasheetpartid-91633-15159914.pdf?src-supplier=Verical; ComponentLink2Description: https://datasheet.ciiva.com/15159/getdatasheetpartid-91633-15159914.pdf?src-supplier=Verical; ComponentLink3URL: https://datasheet.ciiva.com/48463/rk73z-series-eng-jap-tds-48463436.pdf?src-supplier=Distrelec; ComponentLink3Description: https://datasheet.ciiva.com/48463/rk73z-series-eng-jap-tds-48463436.pdf?src-supplier=Distrelec
U1 = STM32F405RGT6: ARM Cortex-M4 32-bit MCU+FPU, 210 DMIPS, 1024 kB Flash, 192 kB Internal RAM, 51 I/Os, 64-pin LQFP, -40 to 85 degC, Tray; Manufacturer: STMicroelectronics; Supply Voltage(Vcc) min (V): 1.8; Supply Voltage(Vcc) max (V): 3.6; Internal RAM Size (kB): 192; I/Os (High Current): 51; D/A Converter: 2x12-bit; FLASH Size (Prog) (kB): 1024; Operating Frequency(F) (Processor speed) (MHz): 168; ComponentLink2Description: Datasheet; PackageVersion: Rev. 4, 06/2013; DatasheetVersion: Rev. 4; Core: ARM Cortex-M4; ComponentLink2URL: http://www.st.com/st-web-ui/static/active/en/resource/technical/document/datasheet/DM00037051.pdf; PackageReference: LQFP64; Packing: Tray; ComponentLink1Description: Manufacturer URL; ComponentLink3URL: http://www.st.com/st-web-ui/static/active/en/resource/technical/document/datasheet/DM00037051.pdf; ComponentLink3Description: Package Specification; Mounting Technology: Surface Mount; ComponentLink1URL: http://www.st.com/web/en/home.html; PackageDescription: 64-Pin Low Profile Quad Flat Package, 10 x 10 mm Body, 0.5 mm Pitch; PartNumber: STM32F405RGT6; Supplier 1: Mouser; Supplier Part Number 1: 511-STM32F405RGT6
U2 = 24LC256-I/SN: MICROCHIP - 24LC256-I/SN - EEPROM, 256 Kbit, 32K x 8 bit, Seriell I2C (2-Draht), 400 kHz, SOIC, 8 Pin(s); Access Time: 900ns; Interface: I2C,Serial,2-Wire; Max Supply Voltage: 5.5V; Min Supply Voltage: 2.5V; Frequency: 400kHz; Density: 256Kb; Nominal Supply Current: 3mA; Voltage: 5V; Supplier 1: Mouser; Supplier Part Number 1: 579-24LC256-I/SN; Manufacturer: Microchip; Manufacturer Part Number: 24LC256-I/SN; RoHS: Yes; Category: EEPROM; Stock 1: 4028; Pricing 1: 1=0.81000, 10=0.81000, 25=0.78000, 100=0.76300, 250=0.76300, 500=0.76300 (USD); Mount: Surface Mount; Case/Package: SOIC; Number of Pins: 8; Min Operating Temperature: -40°C; Max Operating Temperature: 85°C; Packaging: Rail/Tube; Max Frequency: 400kHz; Memory Size: 256Kb; Memory Type: EEPROM; Package Quantity: 100; Length: 4.9mm; Height: 1.5mm; Width: 3.9mm; Radiation Hardening: No; Lead Free: Lead Free; REACH SVHC: No SVHC; ComponentLink1URL: https://datasheet.ciiva.com/1155/1688094-1155208.pdf?src-supplier=Element14; ComponentLink1Description: https://datasheet.ciiva.com/1155/1688094-1155208.pdf?src-supplier=Element14; ComponentLink2URL: https://datasheet.ciiva.com/1155/1688094-1155209.pdf?src-supplier=Element14; ComponentLink2Description: https://datasheet.ciiva.com/1155/1688094-1155209.pdf?src-supplier=Element14; ComponentLink3URL: https://datasheet.ciiva.com/16203/filehandler-aspxddocname-en011849-16203855.pdf?src-supplier=Future+Electronics; ComponentLink3Description: https://datasheet.ciiva.com/16203/filehandler-aspxddocname-en011849-16203855.pdf?src-supplier=Future+Electronics; ComponentLink4URL: https://datasheet.ciiva.com/29294/150247-da-01-en-eeprom-24lc256-i-sn-soic8-mcp-29294965.pdf?src-supplier=Conrad; ComponentLink4Description: https://datasheet.ciiva.com/29294/150247-da-01-en-eeprom-24lc256-i-sn-soic8-mcp-29294965.pdf?src-supplier=Conrad
Y1 = ECS-80-20-5G3XDS-TR: CRYSTAL 8.0000MHZ 20PF SMD; Manufacturer: ECS International; Frequency Tolerance: 30ppm; ESR (Equivalent Series Resistance): 60R; Frequency Stability: 100ppm; Supplier 1: Mouser; Supplier Part Number 1: 520-ECS-80-20-5GXT; Manufacturer Part Number: ECS-80-20-5G3XDS-TR; RoHS: Yes; Category: Crystals; Stock 1: 4314; Pricing 1: 1=0.90000, 10=0.80500, 50=0.75300, 100=0.66500, 500=0.63000, 1000=0.52500 (USD); Mount: Surface Mount; Min Operating Temperature: -40°C; Max Operating Temperature: 125°C; Package Quantity: 1; Frequency: 8MHz; Load Capacitance: 20pF; Packaging: Tape and Reel; Tolerance: 30ppm; Termination: SMD/SMT; Length: 0.449inch; Height: 0.165inch; Width: 0.185inch; ComponentLink1URL: https://datasheet.ciiva.com/852/csm-7x-3l-852790.pdf?src-supplier=Digi-Key; ComponentLink1Description: https://datasheet.ciiva.com/852/csm-7x-3l-852790.pdf?src-supplier=Digi-Key; ComponentLink2URL: https://datasheet.ciiva.com/852/csm-7x-3l-852791.pdf?src-supplier=Digi-Key; ComponentLink2Description: https://datasheet.ciiva.com/852/csm-7x-3l-852791.pdf?src-supplier=Digi-Key; ComponentLink3URL: https://datasheet.ciiva.com/852/csm-7x-3l-852792.pdf?src-supplier=Digi-Key; ComponentLink3Description: https://datasheet.ciiva.com/852/csm-7x-3l-852792.pdf?src-supplier=Digi-Key

## Sheet I2cLevelShifter.SchDoc
size A; DocumentNumber: D_21; SheetNumber: 21; SheetTotal: 21
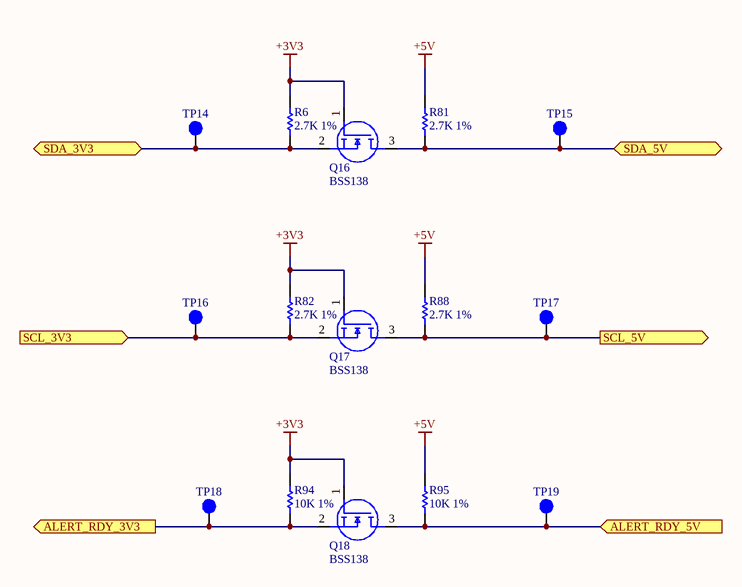
[diagram p5: I2cLevelShifter.SchDoc]

### Parts
Q16  BSS138  [SOT-23-3]
Q17  BSS138  [SOT-23-3]
Q18  BSS138  [SOT-23-3]
R6  2.7K 1%  [R0805]
R81  2.7K 1%  [R0805]
R82  2.7K 1%  [R0805]
R88  2.7K 1%  [R0805]
R94  10K 1%  [R0805]
R95  10K 1%  [R0805]
TP14  T  [TESTPOINTSMD_1x1MM]  (value not drawn)  (no BOM)
TP15  T  [TESTPOINTSMD_1x1MM]  (value not drawn)  (no BOM)
TP16  T  [TESTPOINTSMD_1x1MM]  (value not drawn)  (no BOM)
TP17  T  [TESTPOINTSMD_1x1MM]  (value not drawn)  (no BOM)
TP18  T  [TESTPOINTSMD_1x1MM]  (value not drawn)  (no BOM)
TP19  T  [TESTPOINTSMD_1x1MM]  (value not drawn)  (no BOM)

### Ports
ALERT_RDY_3V3 (out), ALERT_RDY_5V (in), SCL_3V3 (in), SCL_5V (out), SDA_3V3 (bidir), SDA_5V (bidir)

### Nets
+3V3: Q16.1(G) Q17.1(G) Q18.1(G) R6.2 R82.2 R94.2
+5V: R81.2 R88.2 R95.2
ADSRDY: Q18.2(S) R94.1 TP18.1 ; port ALERT_RDY_3V3
ADSRDY5V: Q18.3(D) R95.1 TP19.1 ; port ALERT_RDY_5V
SCL: Q17.2(S) R82.1 TP16.1 ; port SCL_3V3
SDA: Q16.2(S) R6.1 TP14.1 ; port SDA_3V3
NetIC1_9: Q16.3(D) R81.1 TP15.1 ; port SDA_5V
NetIC1_10: Q17.3(D) R88.1 TP17.1 ; port SCL_5V

### Library data of the parts
Q16-Q18 = BSS138: MOSFET N-CH 50V 220MA SOT-23; Manufacturer: ON Semiconductor / Fairchild; Element Configuration: Single; Rds On Max: 3.5R; Input Capacitance: 27pF; Max Power Dissipation: 360mW; Rise Time: 9ns; Turn-Off Delay Time: 20ns; Gate to Source Voltage (Vgs): 20V; Turn-On Delay Time: 2.5ns; Number of Elements: 1; Threshold Voltage: 1.3V; On-State Resistance: 6R; Supplier 1: Mouser; Manufacturer Part Number: BSS138; RoHS: Yes; Category: MOSFETs; Stock 1: 736044; Pricing 1: 1=0.26000, 10=0.17800, 100=0.07400, 1000=0.05000, 3000=0.03900, 9000=0.03300, 24000=0.03100, 45000=0.02900 (USD); Mount: Surface Mount; Case/Package: SOT-23; Number of Pins: 3; Weight: 0.03g; Contact Plating: Tin,Matte; Min Operating Temperature: -55°C; Max Operating Temperature: 150°C; Packaging: Tape and Reel; Continuous Drain Current (ID): 220mA; Drain to Source Voltage (Vdss): 50V; Drain to Source Breakdown Voltage: 50V; Fall Time: 9ns; Drain to Source Resistance: 3.5R; Package Quantity: 1; Power Dissipation: 360mW; Voltage Rating (DC): 50V; Current Rating: 220mA; Nominal Vgs: 1.3V; Dual Supply Voltage: 50V; Termination: SMD/SMT; Length: 2.92mm; Height: 0.93mm; Width: 1.3mm; Radiation Hardening: No; Lead Free: Lead Free; REACH SVHC: No SVHC; ComponentLink1URL: https://datasheet.ciiva.com/931/bss138-931776.pdf?src-supplier=Digi-Key; ComponentLink1Description: https://datasheet.ciiva.com/931/bss138-931776.pdf?src-supplier=Digi-Key; ComponentLink2URL: https://datasheet.ciiva.com/1190/193736-1190130.pdf?src-supplier=Element14; ComponentLink2Description: https://datasheet.ciiva.com/1190/193736-1190130.pdf?src-supplier=Element14; ComponentLink3URL: https://datasheet.ciiva.com/27050/784896-27050043.pdf?src-supplier=Jameco; ComponentLink3Description: https://datasheet.ciiva.com/27050/784896-27050043.pdf?src-supplier=Jameco; ComponentLink4URL: https://datasheet.ciiva.com/1190/193736-1190131.pdf?src-supplier=Element14; ComponentLink4Description: https://datasheet.ciiva.com/1190/193736-1190131.pdf?src-supplier=Element14; ComponentLink5URL: https://datasheet.ciiva.com/1254/193736-1254983.pdf?src-supplier=Newark; ComponentLink5Description: https://datasheet.ciiva.com/1254/193736-1254983.pdf?src-supplier=Newark; ComponentLink6URL: https://datasheet.ciiva.com/16834/bss138-16834843.pdf?src-supplier=Future+Electronics; ComponentLink6Description: https://datasheet.ciiva.com/16834/bss138-16834843.pdf?src-supplier=Future+Electronics; ComponentLink7URL: https://datasheet.ciiva.com/26229/bss138-26229007.pdf?src-supplier=Avnet+Europe; ComponentLink7Description: https://datasheet.ciiva.com/26229/bss138-26229007.pdf?src-supplier=Avnet+Europe; ComponentLink8URL: https://datasheet.ciiva.com/3304/bss138-3304424.pdf?src-supplier=Avnet; ComponentLink8Description: https://datasheet.ciiva.com/3304/bss138-3304424.pdf?src-supplier=Avnet; ComponentLink9URL: https://datasheet.ciiva.com/22655/193736-22655240.pdf?src-supplier=Element14; ComponentLink9Description: https://datasheet.ciiva.com/22655/193736-22655240.pdf?src-supplier=Element14; Supplier Part Number 1: 512-BSS138
R6 R81 R82 R88 = AC0805FR-072K7L: RES SMD 2.7K OHM 1% 1/8W 0805; Manufacturer: Yageo; Resistance: 2.7kR; Temperature Coefficient: 100ppm/°C; Power Rating: 125mW; Voltage Rating: 150V; Supplier 1: Mouser; Supplier Part Number 1: 603-AC0805FR-072K7L; Manufacturer Part Number: AC0805FR-072K7L; RoHS: Yes; Category: Chip SMD Resistors; Stock 1: 3900; Pricing 1: 1=0.16000, 10=0.03700, 100=0.01300, 1000=0.01000, 5000=0.00600, 10000=0.00600 (USD); Case/Package: 0805; Case Code (Metric): 2012; Case Code (Imperial): 0805; Min Operating Temperature: -55°C; Max Operating Temperature: 155°C; Packaging: Tape and Reel; Composition: Thick Film; Tolerance: 1%; Number of Terminations: 2; Termination: SMD/SMT; Max Power Dissipation: 125mW; Features: Moisture Resistant,Automotive AEC-Q200; Length: 0.079inch; Height: 0.024inch; Width: 0.049inch; Lead Free: Lead Free; ComponentLink1URL: https://datasheet.ciiva.com/12656/pyu-ac-51-rohs-l-2-12656732.pdf?src-supplier=Mouser; ComponentLink1Description: https://datasheet.ciiva.com/12656/pyu-ac-51-rohs-l-2-12656732.pdf?src-supplier=Mouser
R94 R95 = CRCW080510K0FKEA: VISHAY - CRCW080510K0FKEA - SMD Chip Resistor, 0805 [2012 Metric], 10 kohm, CRCW e3 Series, 150 V, Thick Film, 125 mW; Resistance: 10kR; Temperature Coefficient: 100ppm/°C; Power Rating: 125mW; Voltage Rating: 150V; Supplier 1: Mouser; Supplier Part Number 1: 71-CRCW0805-10K-E3; Manufacturer: Vishay; Manufacturer Part Number: CRCW080510K0FKEA; RoHS: Yes; Category: Chip SMD Resistors; Stock 1: 1138857; Pricing 1: 1=0.10000, 10=0.06200, 100=0.02500, 1000=0.01000, 5000=0.00700, 10000=0.00600 (USD); Case/Package: 0805; Case Code (Metric): 2012; Case Code (Imperial): 0805; Min Operating Temperature: -55°C; Max Operating Temperature: 155°C; Packaging: Tape and Reel; Composition: Thick Film; Tolerance: 1%; Voltage Rating (DC): 150V; Termination: SMD/SMT; Package Quantity: 5000; Military Standard: Not; Length: 2mm; Height: 0.45mm; Width: 1.25mm; Depth: 1.25mm; Lead Free: Lead Free; REACH SVHC: Unknown; ComponentLink1URL: https://datasheet.ciiva.com/11808/0900766b80d98b26-11808216.pdf?src-supplier=RSComponents; ComponentLink1Description: https://datasheet.ciiva.com/11808/0900766b80d98b26-11808216.pdf?src-supplier=RSComponents; ComponentLink2URL: https://datasheet.ciiva.com/5547/dcrcwe3-109170-5547559.pdf?src-supplier=Mouser; ComponentLink2Description: https://datasheet.ciiva.com/5547/dcrcwe3-109170-5547559.pdf?src-supplier=Mouser; ComponentLink3URL: https://datasheet.ciiva.com/16719/70201119-16719082.pdf?src-supplier=Allied+Electronics; ComponentLink3Description: https://datasheet.ciiva.com/16719/70201119-16719082.pdf?src-supplier=Allied+Electronics; ComponentLink4URL: https://datasheet.ciiva.com/16883/dcrcwe3-16883708.pdf?src-supplier=Avnet+Europe; ComponentLink4Description: https://datasheet.ciiva.com/16883/dcrcwe3-16883708.pdf?src-supplier=Avnet+Europe; ComponentLink5URL: https://datasheet.ciiva.com/8337/dcrcwe3-8337773.pdf?src-supplier=Avnet; ComponentLink5Description: https://datasheet.ciiva.com/8337/dcrcwe3-8337773.pdf?src-supplier=Avnet; ComponentLink6URL: https://datasheet.ciiva.com/46394/1720486-46394381.pdf?src-supplier=Element14; ComponentLink6Description: https://datasheet.ciiva.com/46394/1720486-46394381.pdf?src-supplier=Element14; Weight: 0.000194oz; Contact Plating: Tin; Radiation Hardening: No; ComponentLink7URL: https://datasheet.ciiva.com/16199/dcrcwe3-16199086.pdf?src-supplier=Future+Electronics; ComponentLink7Description: https://datasheet.ciiva.com/16199/dcrcwe3-16199086.pdf?src-supplier=Future+Electronics; ComponentLink8URL: https://datasheet.ciiva.com/16514/dcrcwe3-16514907.pdf?src-supplier=Avnet+Asia; ComponentLink8Description: https://datasheet.ciiva.com/16514/dcrcwe3-16514907.pdf?src-supplier=Avnet+Asia; ComponentLink9URL: https://datasheet.ciiva.com/16755/70201119-16755389.pdf?src-supplier=Allied+Electronics; ComponentLink9Description: https://datasheet.ciiva.com/16755/70201119-16755389.pdf?src-supplier=Allied+Electronics; ComponentLink10URL: https://datasheet.ciiva.com/8337/dcrcwe3-8337774.pdf?src-supplier=Avnet; ComponentLink10Description: https://datasheet.ciiva.com/8337/dcrcwe3-8337774.pdf?src-supplier=Avnet
TP14-TP19 = TestPoint_SMD_1x1: SMD Test Point